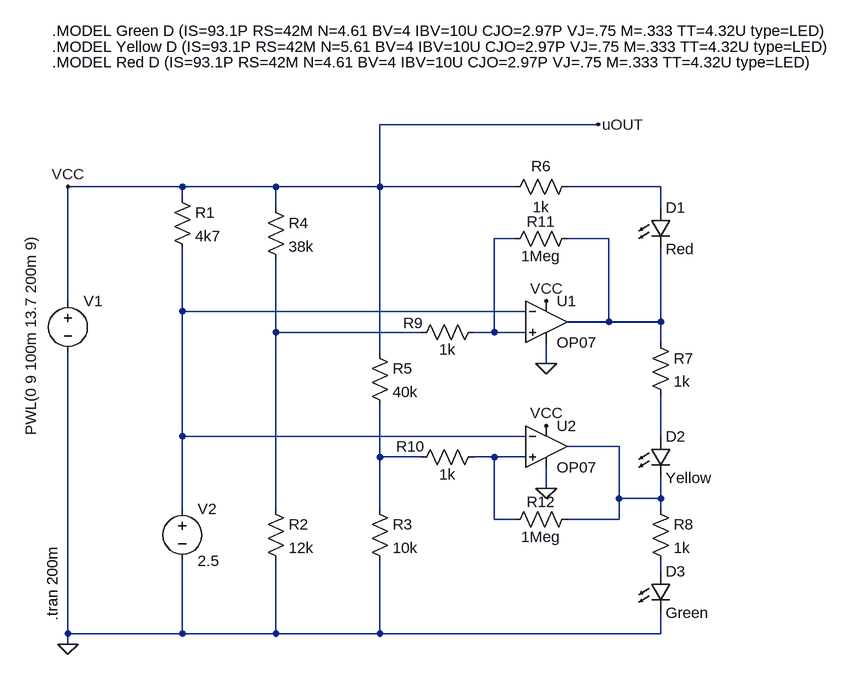
[diagram p0: schematic BLR.asc]
BLR.asc, the LTspice schematic file:
Version 4
SHEET 1 912 680
WIRE 464 -272 128 -272
WIRE -176 -176 -352 -176
WIRE -32 -176 -176 -176
WIRE 128 -176 128 -272
WIRE 128 -176 -32 -176
WIRE 336 -176 128 -176
WIRE 560 -176 416 -176
WIRE -176 -160 -176 -176
WIRE -32 -144 -32 -176
WIRE 560 -144 560 -176
WIRE 336 -96 304 -96
WIRE 480 -96 416 -96
WIRE -352 0 -352 -176
WIRE -176 16 -176 -80
WIRE 352 16 -176 16
WIRE 480 32 480 -96
WIRE 480 32 416 32
WIRE 560 32 560 -80
WIRE 560 32 480 32
WIRE -32 48 -32 -64
WIRE 192 48 -32 48
WIRE 304 48 304 -96
WIRE 304 48 272 48
WIRE 352 48 304 48
WIRE 560 64 560 32
WIRE 128 80 128 -176
WIRE 384 96 384 64
WIRE -176 208 -176 16
WIRE 352 208 -176 208
WIRE 560 208 560 144
WIRE 496 224 416 224
WIRE 128 240 128 160
WIRE 192 240 128 240
WIRE 304 240 272 240
WIRE 352 240 304 240
WIRE 384 288 384 256
WIRE 496 304 496 224
WIRE 560 304 560 272
WIRE 560 304 496 304
WIRE -176 320 -176 208
WIRE -32 320 -32 48
WIRE 128 320 128 240
WIRE 560 320 560 304
WIRE 304 336 304 240
WIRE 336 336 304 336
WIRE 496 336 496 304
WIRE 496 336 416 336
WIRE 560 416 560 400
WIRE -352 512 -352 80
WIRE -176 512 -176 400
WIRE -176 512 -352 512
WIRE -32 512 -32 400
WIRE -32 512 -176 512
WIRE 128 512 128 400
WIRE 128 512 -32 512
WIRE 560 512 560 480
WIRE 560 512 128 512
WIRE -352 528 -352 512
FLAG 384 0 VCC
FLAG 384 192 VCC
FLAG 384 96 0
FLAG 384 288 0
FLAG -352 528 0
FLAG 464 -272 uOUT
FLAG -352 -176 VCC
SYMBOL voltage -352 -16 R0
WINDOW 123 0 0 Left 0
WINDOW 39 0 0 Left 0
WINDOW 3 -57 -88 VRight 2
SYMATTR Value PWL(0 9 100m 13.7 200m 9)
SYMATTR InstName V1
SYMBOL res -192 -176 R0
SYMATTR InstName R1
SYMATTR Value 4k7
SYMBOL OpAmps\\OP07 384 -32 R0
SYMATTR InstName U1
SYMBOL voltage -176 304 R0
WINDOW 123 0 0 Left 0
WINDOW 39 0 0 Left 0
SYMATTR InstName V2
SYMATTR Value 2.5
SYMBOL OpAmps\\OP07 384 160 R0
SYMATTR InstName U2
SYMBOL res -48 304 R0
SYMATTR InstName R2
SYMATTR Value 12k
SYMBOL res 112 304 R0
SYMATTR InstName R3
SYMATTR Value 10k
SYMBOL res -48 -160 R0
SYMATTR InstName R4
SYMATTR Value 38k
SYMBOL res 112 64 R0
SYMATTR InstName R5
SYMATTR Value 40k
SYMBOL LED 544 -144 R0
SYMATTR InstName D1
SYMATTR Value Red
SYMBOL res 320 -160 R270
WINDOW 0 32 56 VTop 2
WINDOW 3 0 56 VBottom 2
SYMATTR InstName R6
SYMATTR Value 1k
SYMBOL res 544 48 R0
SYMATTR InstName R7
SYMATTR Value 1k
SYMBOL LED 544 208 R0
SYMATTR InstName D2
SYMATTR Value Yellow
SYMBOL res 544 304 R0
SYMATTR InstName R8
SYMATTR Value 1k
SYMBOL LED 544 416 R0
SYMATTR InstName D3
SYMATTR Value Green
SYMBOL res 176 64 R270
WINDOW 0 15 3 VTop 2
WINDOW 3 5 56 VBottom 2
SYMATTR InstName R9
SYMATTR Value 1k
SYMBOL res 176 256 R270
WINDOW 0 17 -1 VTop 2
WINDOW 3 5 56 VBottom 2
SYMATTR InstName R10
SYMATTR Value 1k
SYMBOL res 432 -112 R90
WINDOW 0 5 56 VBottom 2
WINDOW 3 27 56 VTop 2
SYMATTR InstName R11
SYMATTR Value 1Meg
SYMBOL res 432 320 R90
WINDOW 0 5 56 VBottom 2
WINDOW 3 27 56 VTop 2
SYMATTR InstName R12
SYMATTR Value 1Meg
TEXT -376 376 VRight 2 !.tran 200m
TEXT -376 -368 Left 2 !.MODEL Red D (IS=93.1P RS=42M N=4.61 BV=4 IBV=10U CJO=2.97P VJ=.75 M=.333 TT=4.32U type=LED)
TEXT -376 -392 Left 2 !.MODEL Yellow D (IS=93.1P RS=42M N=5.61 BV=4 IBV=10U CJO=2.97P VJ=.75 M=.333 TT=4.32U type=LED)
TEXT -376 -416 Left 2 !.MODEL Green D (IS=93.1P RS=42M N=4.61 BV=4 IBV=10U CJO=2.97P VJ=.75 M=.333 TT=4.32U type=LED)

The netlist it stands for:
* BLR.asc
V1 uOUT 0 PWL(0 9 100m 13.7 200m 9)
R1 uOUT N004 4k7
XU1 N002 N004 uOUT 0 N003 LT1001  ; OP07, pins In+ In- V+ V- OUT
V2 N004 0 2.5
XU2 N009 N004 uOUT 0 N007 LT1001  ; OP07, pins In+ In- V+ V- OUT
R2 N005 0 12k
R3 N008 0 10k
R4 uOUT N005 38k
R5 uOUT N008 40k
D1 N001 N003 Red
R6 uOUT N001 1k
R7 N003 N006 1k
D2 N006 N007 Yellow
R8 N007 N010 1k
D3 N010 0 Green
R9 N005 N002 1k
R10 N008 N009 1k
R11 N003 N002 1Meg
R12 N007 N009 1Meg
.model D D
.lib standard.dio
.tran 200m
.MODEL Red D (IS=93.1P RS=42M N=4.61 BV=4 IBV=10U CJO=2.97P VJ=.75 M=.333 TT=4.32U type=LED)
.MODEL Yellow D (IS=93.1P RS=42M N=5.61 BV=4 IBV=10U CJO=2.97P VJ=.75 M=.333 TT=4.32U type=LED)
.MODEL Green D (IS=93.1P RS=42M N=4.61 BV=4 IBV=10U CJO=2.97P VJ=.75 M=.333 TT=4.32U type=LED)
.lib LTC.lib
.backanno
.end